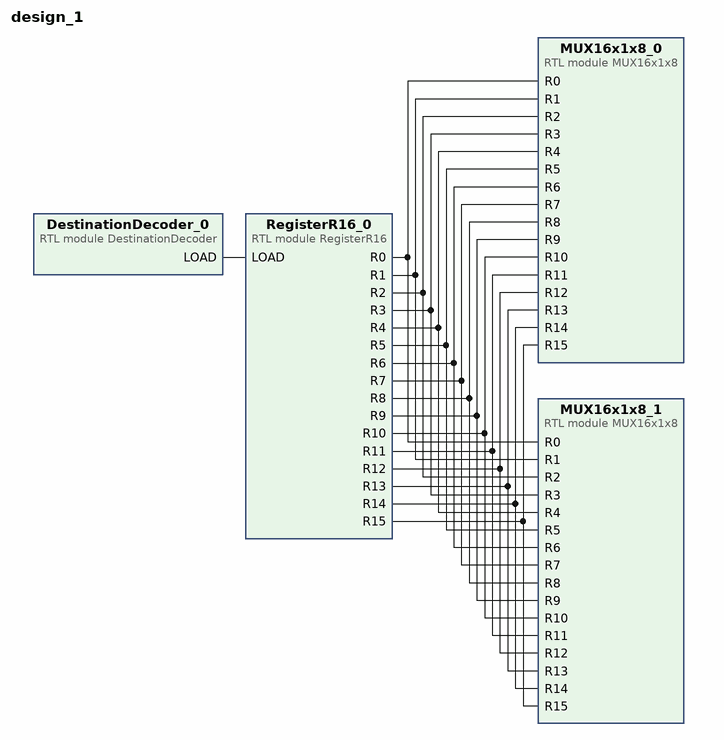
[diagram p0: block diagram of the top level]
# Vivado block design design_1, xc7a100tcsg324-1, Vivado 2018.2
create_bd_design design_1

create_bd_cell -type module -reference DestinationDecoder DestinationDecoder_0
create_bd_cell -type module -reference RegisterR16 RegisterR16_0
create_bd_cell -type module -reference MUX16x1x8 MUX16x1x8_0
create_bd_cell -type module -reference MUX16x1x8 MUX16x1x8_1

# ---- connections ----

connect_bd_net [get_bd_pins DestinationDecoder_0/LOAD] [get_bd_pins RegisterR16_0/LOAD]
connect_bd_net [get_bd_pins RegisterR16_0/R0] [get_bd_pins MUX16x1x8_0/R0] [get_bd_pins MUX16x1x8_1/R0]
connect_bd_net [get_bd_pins RegisterR16_0/R1] [get_bd_pins MUX16x1x8_0/R1] [get_bd_pins MUX16x1x8_1/R1]
connect_bd_net [get_bd_pins RegisterR16_0/R2] [get_bd_pins MUX16x1x8_0/R2] [get_bd_pins MUX16x1x8_1/R2]
connect_bd_net [get_bd_pins RegisterR16_0/R3] [get_bd_pins MUX16x1x8_0/R3] [get_bd_pins MUX16x1x8_1/R3]
connect_bd_net [get_bd_pins RegisterR16_0/R4] [get_bd_pins MUX16x1x8_0/R4] [get_bd_pins MUX16x1x8_1/R4]
connect_bd_net [get_bd_pins RegisterR16_0/R5] [get_bd_pins MUX16x1x8_0/R5] [get_bd_pins MUX16x1x8_1/R5]
connect_bd_net [get_bd_pins RegisterR16_0/R6] [get_bd_pins MUX16x1x8_0/R6] [get_bd_pins MUX16x1x8_1/R6]
connect_bd_net [get_bd_pins RegisterR16_0/R7] [get_bd_pins MUX16x1x8_0/R7] [get_bd_pins MUX16x1x8_1/R7]
connect_bd_net [get_bd_pins RegisterR16_0/R8] [get_bd_pins MUX16x1x8_0/R8] [get_bd_pins MUX16x1x8_1/R8]
connect_bd_net [get_bd_pins RegisterR16_0/R9] [get_bd_pins MUX16x1x8_0/R9] [get_bd_pins MUX16x1x8_1/R9]
connect_bd_net [get_bd_pins RegisterR16_0/R10] [get_bd_pins MUX16x1x8_0/R10] [get_bd_pins MUX16x1x8_1/R10]
connect_bd_net [get_bd_pins RegisterR16_0/R11] [get_bd_pins MUX16x1x8_0/R11] [get_bd_pins MUX16x1x8_1/R11]
connect_bd_net [get_bd_pins RegisterR16_0/R12] [get_bd_pins MUX16x1x8_0/R12] [get_bd_pins MUX16x1x8_1/R12]
connect_bd_net [get_bd_pins RegisterR16_0/R13] [get_bd_pins MUX16x1x8_0/R13] [get_bd_pins MUX16x1x8_1/R13]
connect_bd_net [get_bd_pins RegisterR16_0/R14] [get_bd_pins MUX16x1x8_0/R14] [get_bd_pins MUX16x1x8_1/R14]
connect_bd_net [get_bd_pins RegisterR16_0/R15] [get_bd_pins MUX16x1x8_0/R15] [get_bd_pins MUX16x1x8_1/R15]

validate_bd_design
save_bd_design
